# EAGLE design LCD BackPack (EAGLE 9.5.2)
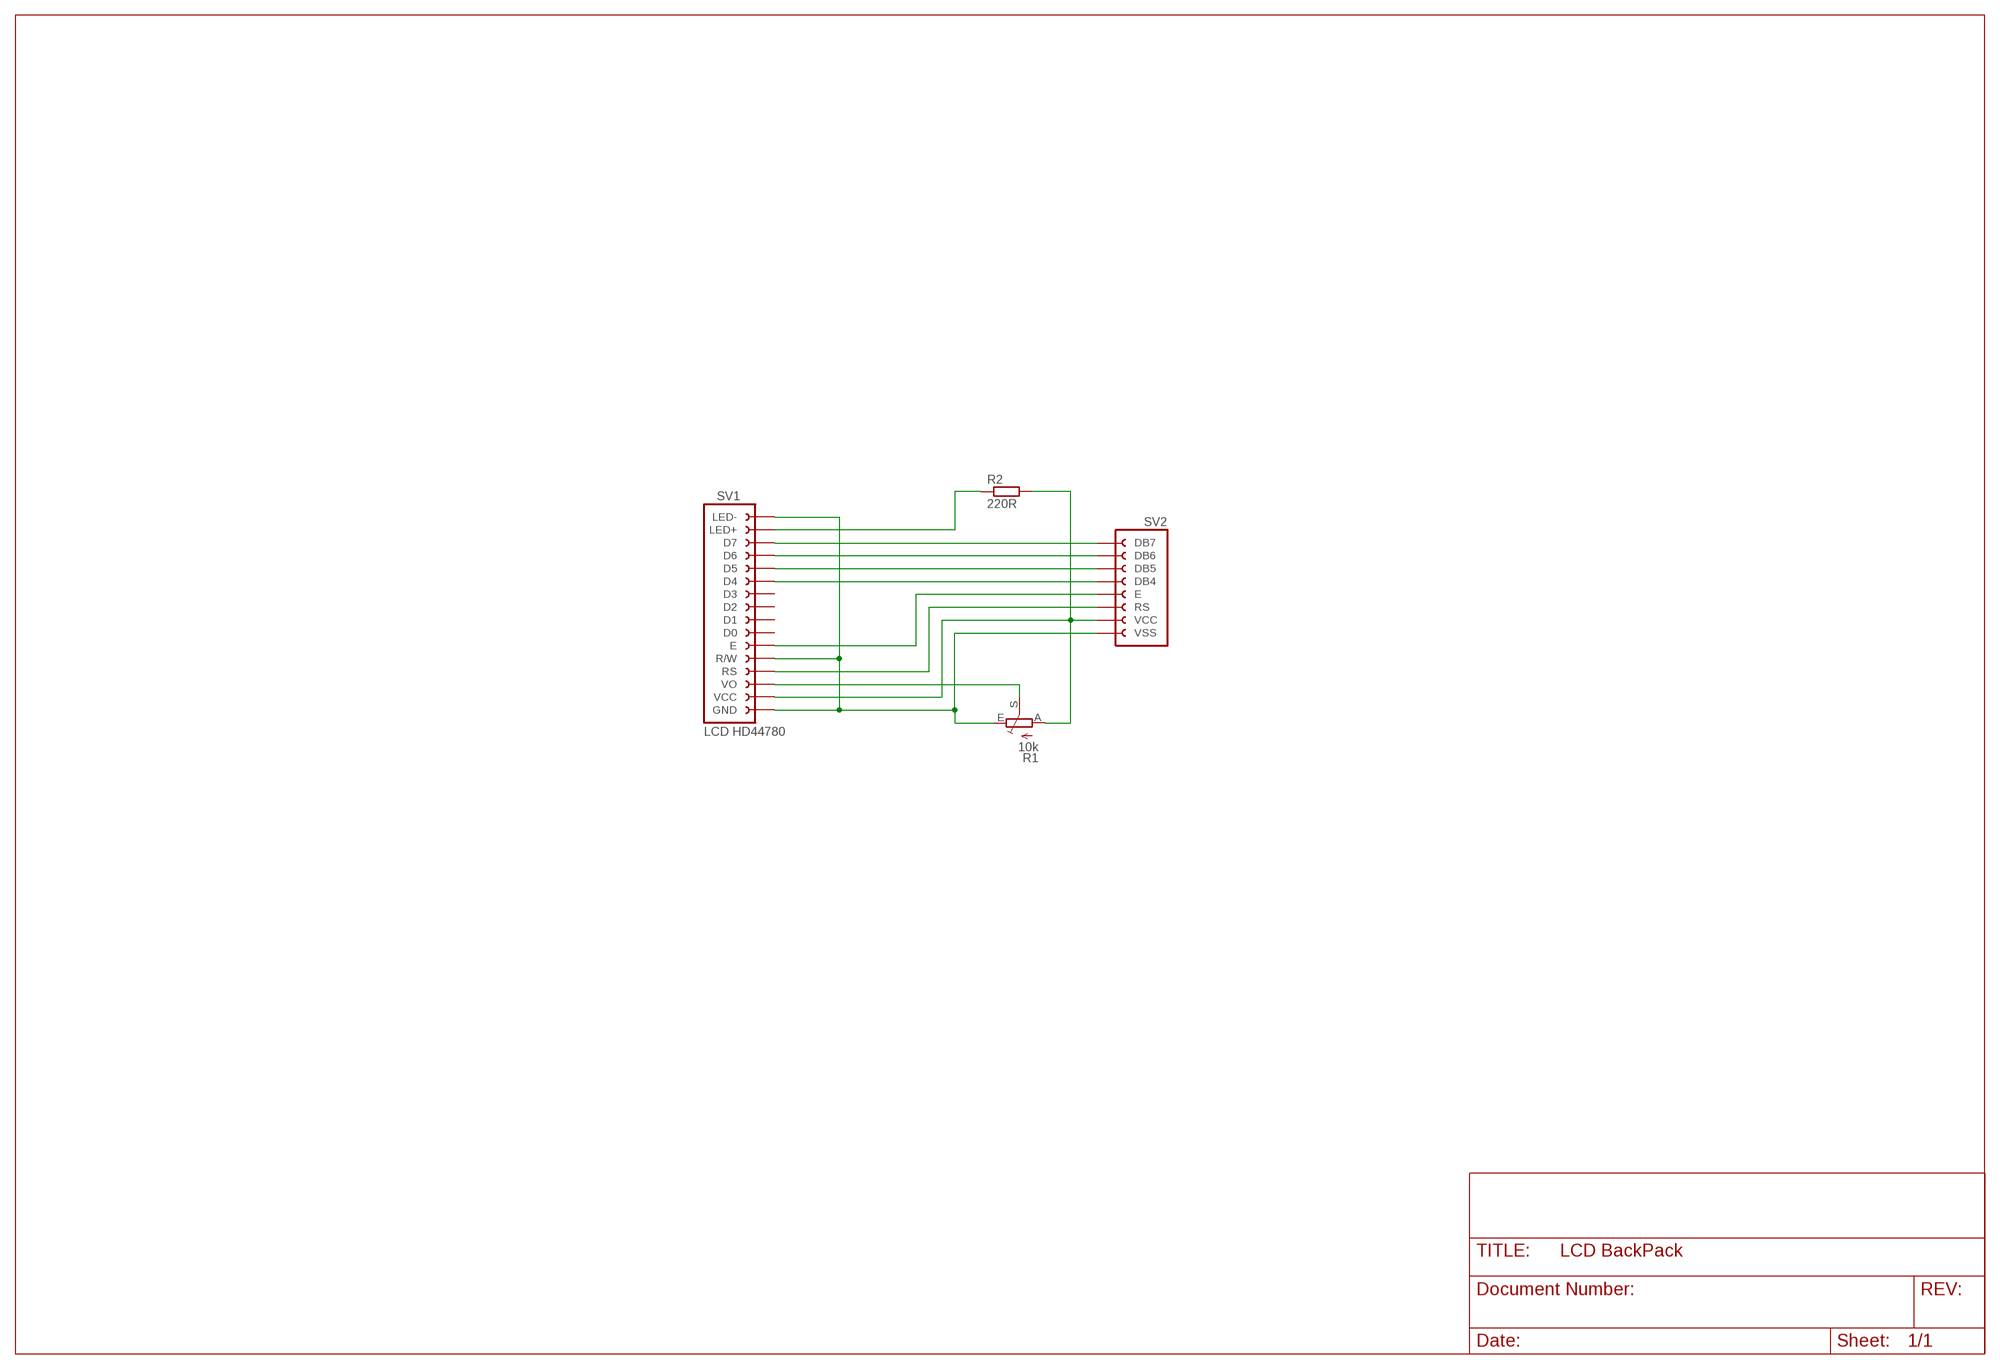
[diagram p0: schematic, sheet 1]

## Parts
R1  10k  POTENTIOMETER_CA6VCA6V  [CA6V]
R2  220R  R-EU_0204/7  [0204/7]
SV1  LCD-HD44780-16-PIN_FEMALE_HEADER  [LCD-HD44780-16-PIN_FEMALE_HEADER]
SV2  LCD-CONTROL_8-PIN_FEMALE_HEADER  [LCD-CONTROL_8-PIN_FEMALE_HEADER]

## Nets
N$1 [My1]: SV1.D7 SV2.DB7
N$2 [My1]: SV1.D6 SV2.DB6
N$3 [My1]: SV1.D5 SV2.DB5
N$4 [My1]: SV1.D4 SV2.DB4
N$5 [My1]: SV1.E SV2.E
N$6 [My1]: SV1.RS SV2.RS
N$7 [My1]: R1.A R2.2 SV1.VCC SV2.VCC
N$8 [My1]: R1.E SV1.GND SV1.LED- SV1.R/W SV2.VSS
N$10 [My1]: R1.S SV1.VO
N$12 [My1]: R2.1 SV1.LED+
Unconnected: SV1.D0 SV1.D1 SV1.D2 SV1.D3

## Library data of the parts
R1 = myLib-04-OftenUsed:POTENTIOMETER_CA6V: TRIM POTENTIOMETER Trim Potentiometer CA6V
R2 = resistor:R-EU_: RESISTOR, European symbol
SV1 = myLib-01-Headers:LCD-HD44780-16-PIN_FEMALE_HEADER: Header for the 16 pin HD44780 LCD module Female; OC_FARNELL: unknown; OC_NEWARK: unknown
SV2 = myLib-01-Headers:LCD-CONTROL_8-PIN_FEMALE_HEADER: LCD-Control 8-pin FEMALE HEADER

## Net classes
1 My1: width 0.762 mm, clearance 0.254 mm

## Board
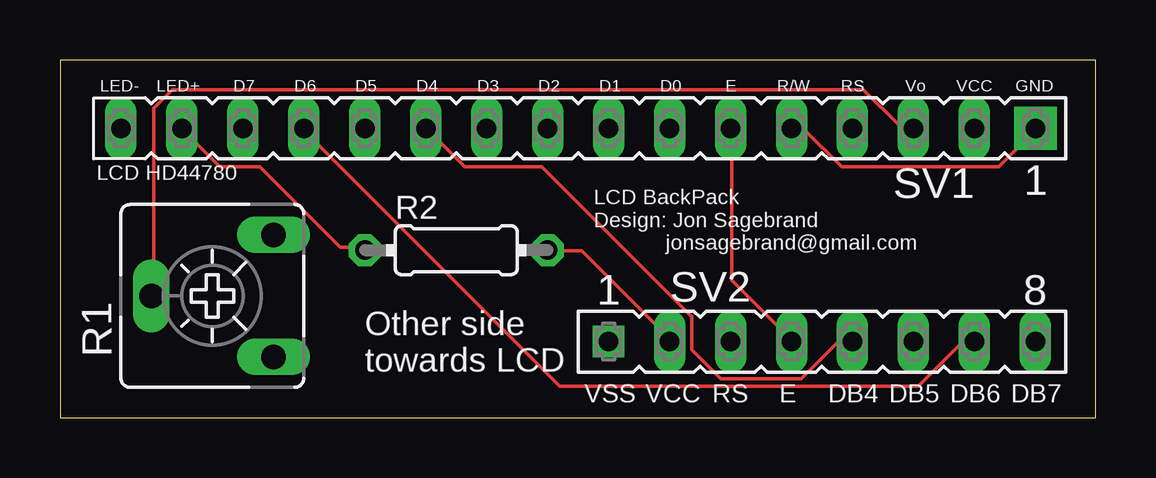
[diagram p1: board, top side]
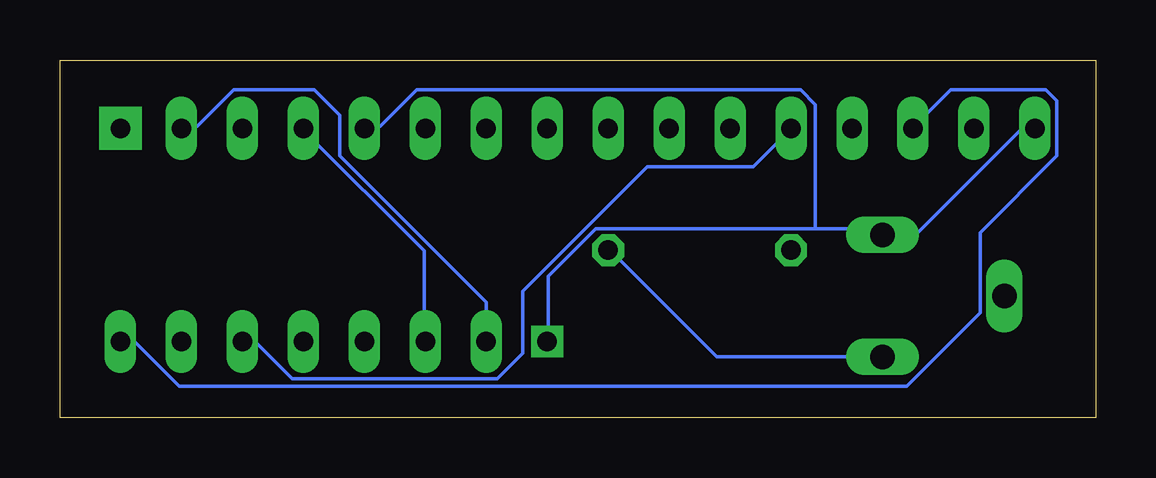
[diagram p2: board, bottom side, seen from below]

Size 43.16 x 14.91 mm. Coordinates in mm from the lower left corner, seen from the top.
Outline: 0,0 43.16,0 43.16,14.91 0,14.91 0,0
Copper layers (1*16): Top 0.035mm / dielectric 1.5mm / Bottom 0.035mm
Design rules "default": minimum track width 6mil, minimum drill 0.35mm, track to track 6mil, track to pad 6mil, pad to pad 6mil, via to via 6mil, smd to smd 6mil, copper to edge 40mil, drill to drill 6mil, minimum pad ring 10mil, minimum via ring 8mil, stop-mask expansion 4mil, vias tented up to drill 0mil, thermal gap 10mil

### Footprints (pad centres in the part's own frame; a part is rotated, then mirrored left to right if it is on the bottom)
CA6V = drill 1.016 long: A -2.54,-2.54; E 2.54,-2.54; S 0,2.54
0204/7 = drill 0.813 octagon: 1 -3.81,0; 2 3.81,0
LCD-HD44780-16-PIN_FEMALE_HEADER = drill 0.813 long: D0 15.24,0; D1 17.78,0; D2 20.32,0; D3 22.86,0; D4 25.4,0; D5 27.94,0; D6 30.48,0; D7 33.02,0; E 12.7,0; LED+ 35.56,0; LED- 38.1,0; R/W 10.16,0; RS 7.62,0; VCC 2.54,0; VO 5.08,0 | drill 0.813 pad 1.778 square: GND 0,0
LCD-CONTROL_8-PIN_FEMALE_HEADER = drill 0.813 long: DB4 10.16,0; DB5 12.7,0; DB6 15.24,0; DB7 17.78,0; E 7.62,0; RS 5.08,0; VCC 2.54,0 | drill 0.813 square: VSS 0,0

### Placement (x,y rotation side)
R1  6.35,5.08 90 top
R2  16.51,6.98 0 top
SV1  40.64,12.06 180 top
SV2  22.86,3.17 0 top

### Tracks (layer width: path | path; a pad name or v marks a point on that pad's centre or on a via)
N$1
  Bottom 0.152: SV2.DB7 40.64,3.15 40.03,3.15 38.2,1.32 7.87,1.32 4.83,4.37 4.83,7.72 1.63,10.92 1.63,13.21 2.08,13.66 6.04,13.66 7.57,12.14 SV1.D7
N$2
  Top 0.152: SV2.DB6 38.05,3.15 37.59,3.15 35.76,1.32 20.83,1.32 10.16,11.99 SV1.D6
N$3
  Bottom 0.152: SV2.DB5 35.46,3.15 35,3.15 33.48,1.63 24.94,1.63 23.88,2.69 23.88,5.28 18.69,10.47 14.28,10.47 12.75,11.99 SV1.D5
N$4
  Top 0.152: SV2.DB4 33.02,3.15 32.41,3.15 30.89,1.63 27.53,1.63 26.31,2.84 26.31,4.22 20.07,10.47 16.87,10.47 15.34,11.99 SV1.D4
N$5
  Top 0.152: SV1.E 27.99,11.99 27.99,5.74 30.43,3.3 SV2.E
N$6
  Bottom 0.152: SV2.RS 27.99,3.3 27.99,6.96 33.02,11.99 SV1.RS
N$7
  Top 0.152: R2.2 20.37,6.96 21.74,6.96 25.4,3.3 SV2.VCC
  Bottom 0.152: SV2.VCC 25.4,4.83 31.5,10.92 31.5,12.6 32.56,13.66 35.92,13.66 37.44,12.14 38.05,12.14 SV1.VCC | R1.A 15.8,2.54 20.22,6.96 R2.2
N$8
  Top 0.152: SV1.R/W 30.58,11.99 31.04,11.99 32.56,10.47 39.12,10.47 40.64,11.99 SV1.GND
  Bottom 0.152: 11.68,7.87 9.09,7.87 8.94,7.72 R1.E 8.79,7.72 7.42,7.72 3.15,11.99 2.54,11.99 SV1.LED- | 11.68,7.87 20.83,7.87 22.81,5.89 22.81,3.3 SV2.VSS | 11.68,7.87 11.68,13.06 12.29,13.66 28.3,13.66 29.82,12.14 30.43,12.14 SV1.R/W
N$10
  Top 0.152: SV1.VO 35.46,12.14 35,12.14 33.48,13.66 4.67,13.66 3.91,12.9 3.91,5.13 R1.S
N$12
  Top 0.152: R2.1 12.6,7.11 11.68,7.11 8.33,10.47 6.65,10.47 5.13,11.99 SV1.LED+

### Text on the board
tPlace: LCD BackPack / Design: Jon Sagebrand / jonsagebrand@gmail.com | Other side / towards LCD